# EAGLE design kuechenlicht (EAGLE 6.5.0)
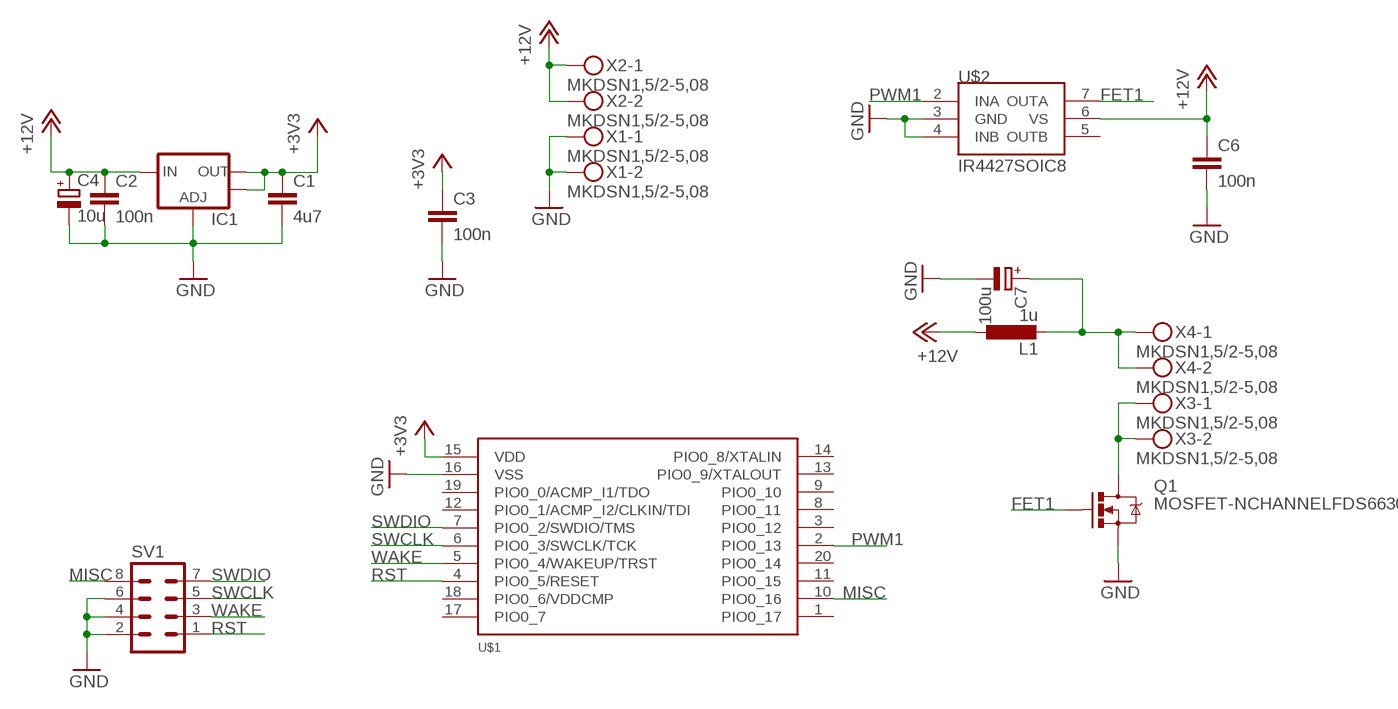
[diagram p0: schematic, sheet 1]

## Parts
C1  4u7  C-EUC0805  [C0805]
C2  100n  C-EUC0805  [C0805]
C3  100n  C-EUC0805  [C0805]
C4  10u  CPOL-EUE2.5-6  [E2,5-6]
C6  100n  C-EUC0805  [C0805]
C7  100u  CPOL-EUPANASONIC_D-BIGPAD  [PANASONIC_D-BIGPAD]
IC1  V_REG_LM1117SOT223  [SOT223]
L1  1u  L-EUPISR-BIGPAD  [PISR-BIGPAD]
Q1  MOSFET-NCHANNELFDS6630A  [SO08]
SV1  MA04-2  [MA04-2]
U$1  LPC812M101JD20  [SOIC20WIDE]
U$2  IR4427SOIC8  [SOIC8]
X1  MKDSN1,5/2-5,08  [MKDSN1,5/2-5,08]
X2  MKDSN1,5/2-5,08  [MKDSN1,5/2-5,08]
X3  MKDSN1,5/2-5,08  [MKDSN1,5/2-5,08]
X4  MKDSN1,5/2-5,08  [MKDSN1,5/2-5,08]

## Nets
+3V3: C1.1 C3.1 IC1.2(OUT) IC1.4(OUT) U$1.15(VDD)
+12V: C2.1 C4.+ C6.1 IC1.3(IN) L1.1 U$2.6(VS) X2.1 X2.2
FET1: Q1.4(G) U$2.7(OUTA)
GND: C1.2 C2.2 C3.2 C4.- C6.2 C7.- IC1.1(ADJ) Q1.1(S) Q1.2(S) Q1.3(S) SV1.2 SV1.4 SV1.6 U$1.16(VSS) U$2.3(GND) U$2.4(INB) X1.1 X1.2
MISC: SV1.8 U$1.10(PIO0_16)
N$1: C7.+ L1.2 X4.1 X4.2
OUT: Q1.5(D) Q1.6(D) Q1.7(D) Q1.8(D) X3.1 X3.2
PWM1: U$1.2(PIO0_13) U$2.2(INA)
RST: SV1.1 U$1.4(PIO0_5/RESET)
SWCLK: SV1.5 U$1.6(PIO0_3/SWCLK/TCK)
SWDIO: SV1.7 U$1.7(PIO0_2/SWDIO/TMS)
WAKE: SV1.3 U$1.5(PIO0_4/WAKEUP/TRST)
Unconnected: U$1.1(PIO0_17) U$1.3(PIO0_12) U$1.8(PIO0_11) U$1.9(PIO0_10) U$1.11(PIO0_15) U$1.12(PIO0_1/ACMP_I2/CLKIN/TDI) U$1.13(PIO0_9/XTALOUT) U$1.14(PIO0_8/XTALIN) U$1.17(PIO0_7) U$1.18(PIO0_6/VDDCMP) U$1.19(PIO0_0/ACMP_I1/TDO) U$1.20(PIO0_14) U$2.5(OUTB)

## Library data of the parts
C1-C3 C6 = rcl:C-EU: CAPACITOR, European symbol
C4 = rcl:CPOL-EU: POLARIZED CAPACITOR, European symbol
C7 = florolf:CPOL-EU: POLARIZED CAPACITOR, European symbol
IC1 = SparkFun-PowerIC:V_REG_LM1117: Voltage Regulator LM1117 Standard adjustable voltage regulator but in SMD form. Spark Fun Electronics SKU : COM-00595
L1 = florolf:L-EU: INDUCTOR, European symbol
Q1 = SparkFun-DiscreteSemi:MOSFET-NCHANNEL: Common NMOSFET Parts MFG P/N Store ID Prod ID FDD8780 TRANS-09984 SI7820DN TRANS-11055 FDS6630A IC-08089 2N7002PW TRANS-11151 FQP30N06L COM-10213 TRANS-10060 BSS123LT1G TRANS-08345 BSS138 TRANS-00830 BS170 2N7000; PROD_ID: IC-08089
SV1 = con-lstb:MA04-2: PIN HEADER; OC_FARNELL: unknown; OC_NEWARK: unknown
U$1 = LPC800:LPC812M101JD20
U$2 = florolf:IR4427
X1-X4 = con-phoenix-508:MKDSN1,5/2-5,08: MKDSN 1,5/ 2-5,08 Printklemme Nennstrom: 13,5 A Nennspannung: 250 V Rastermaß: 5,08 mm Polzahl: 2 Anschlussart: Schraubanschluss Montage: Löten Anschlussrichtung Leiter/Platine: 0 ° Artikelnummer: 1729128 Source: http://eshop.phoenixcontact.com .. 1729128.pdf; MPN: MKDSN 1,5/2-5.08; OC_FARNELL: 1792903; OC_NEWARK: 30M2397

## Board
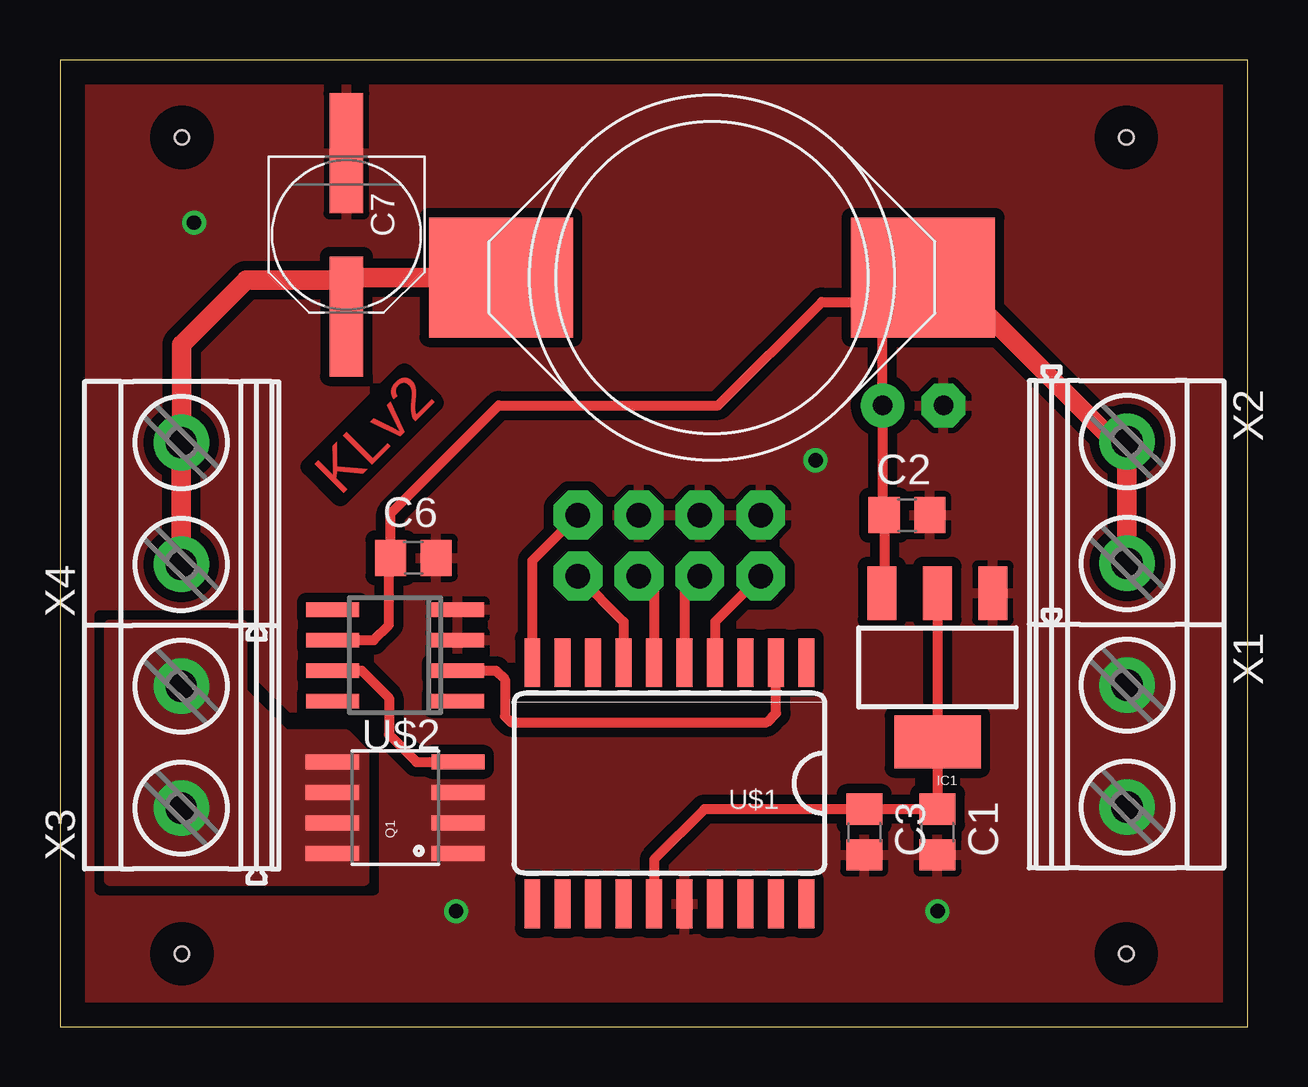
[diagram p1: board, top side]
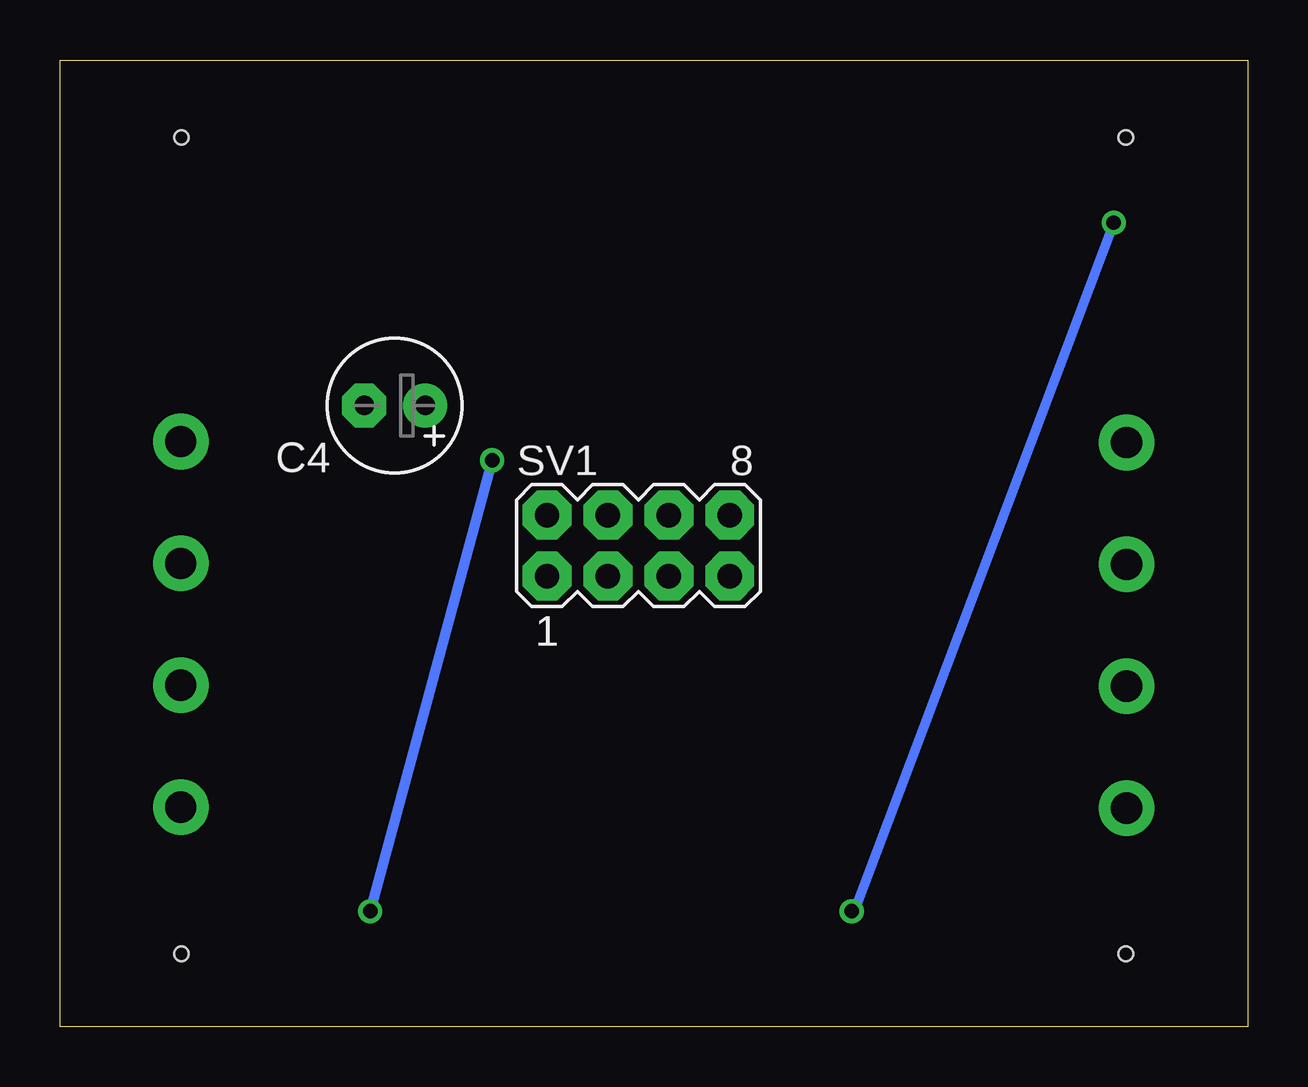
[diagram p2: board, bottom side, seen from below]

Size 49.51 x 40.31 mm. Coordinates in mm from the lower left corner, seen from the top.
Outline: 0,0 49.51,0 49.51,40.31 0,40.31 0,0
Copper layers (1*16): Top 0.035mm / dielectric 1.5mm / Bottom 0.035mm
Design rules "fraesen *": minimum track width 10mil, minimum drill 24mil, track to track 0.4mm, track to pad 0.4mm, pad to pad 0.4mm, via to via 0.4mm, smd to smd 0.4mm, copper to edge 40mil, drill to drill 8mil, minimum pad ring 20mil, minimum via ring 8mil, stop-mask expansion 4mil, vias tented up to drill 0mil, thermal gap 10mil
Holes 0.6 mm at 5.08,3.05 44.45,3.05 44.45,37.08 5.08,37.08

### Footprints (pad centres in the part's own frame; a part is rotated, then mirrored left to right if it is on the bottom)
C0805 = smd 1.3 x 1.5: 1 -0.95,0; 2 0.95,0
E2,5-6 = drill 0.813 pad 1.6: + -1.27,0 | drill 0.813 pad 1.6 octagon: - 1.27,0
PANASONIC_D-BIGPAD = smd 5 x 1.4: + 3.4,0; - -3.4,0
SOT223 = smd 1.219 x 2.235: 1 -2.311,-3.099; 2 0,-3.099; 3 2.311,-3.099 | smd 3.6 x 2.2: 4 0,3.099
PISR-BIGPAD = smd 6 x 5: 1 -8.8,0; 2 8.8,0
SO08 = smd 0.61 x 2.21: 1 -1.905,-2.616; 2 -0.635,-2.616; 3 0.635,-2.616; 4 1.905,-2.616; 5 1.905,2.616; 6 0.635,2.616; 7 -0.635,2.616; 8 -1.905,2.616
MA04-2 = drill 1.016 octagon: 1 -3.81,-1.27; 2 -3.81,1.27; 3 -1.27,-1.27; 4 -1.27,1.27; 5 1.27,-1.27; 6 1.27,1.27; 7 3.81,-1.27; 8 3.81,1.27
SOIC20WIDE = smd 0.66 x 2.032: 1 -5.715,-5.029; 2 -4.445,-5.029; 3 -3.175,-5.029; 4 -1.905,-5.029; 5 -0.635,-5.029; 6 0.635,-5.029; 7 1.905,-5.029; 8 3.175,-5.029; 9 4.445,-5.029; 10 5.715,-5.029; 11 5.715,5.029; 12 4.445,5.029; 13 3.175,5.029; 14 1.905,5.029; 15 0.635,5.029; 16 -0.635,5.029; 17 -1.905,5.029; 18 -3.175,5.029; 19 -4.445,5.029; 20 -5.715,5.029
SOIC8 = smd 0.6 x 2.2: 1 -1.905,-2.6; 2 -0.635,-2.6; 3 0.635,-2.6; 4 1.905,-2.6; 5 1.905,2.6; 6 0.635,2.6; 7 -0.635,2.6; 8 -1.905,2.6
MKDSN1,5/2-5,08 = drill 1.3 pad 2: 1 -2.561,0.025; 2 2.519,0.025

### Placement (x,y rotation side)
C1  36.58,8.13 270 top
C2  35.31,21.34 0 top
C3  33.53,8.13 270 top
C4  35.56,25.91 180 bottom
C6  14.73,19.56 0 top
C7  11.94,33.02 270 top
IC1  36.58,14.99 180 top
L1  27.18,31.24 180 top
Q1  13.97,9.14 90 top
SV1  25.4,20.07 0 bottom
U$1  25.4,10.16 180 top
U$2  13.97,15.49 90 top
X1  44.45,11.68 270 top
X2  44.45,21.84 270 top
X3  5.08,11.68 90 top
X4  5.08,21.84 90 top

### Tracks (layer width: path | path; a pad name or v marks a point on that pad's centre or on a via)
+3V3
  Top 0.406: U$1.15 24.77,6.99 26.86,9.08 C3.1 C1.1 IC1.4 IC1.2
+12V
  Top 0.406: U$2.6 13.08,16.13 13.72,16.76 13.72,19.49 C6.1 13.78,21.4 18.29,25.91 27.43,25.91 31.75,30.23 34.96,30.23 | IC1.3 34.36,18.18 C2.1 34.29,21.4 C4.+ 34.29,29.55 34.96,30.23 | L1.1 35.26,30.52 34.96,30.23
  Top 0.813: X2.1 44.48,23.88 | 44.48,23.88 X2.2 | L1.1 37.11,31.24 44.48,23.88
FET1
  Top 0.406: U$2.7 12.57,14.86 13.72,13.72 13.72,12.19 14.86,11.05 Q1.4
GND  (via drill 0.6)
  Bottom 0.406: v5.59,33.53 16.51,4.57 | v31.5,23.62 v36.58,4.83
  other vias: 16.51,4.83
  pour Top (rank 2): -1.27,41.91 -1.27,-1.27 50.8,-1.27 50.8,41.91
  pour Top (no thermals): 14.99,10.41 18.29,10.41 18.29,6.35 14.99,6.35
  pour Top (no thermals): 40.39,16.76 40.39,6.1 48.01,6.1 48.01,16.76
MISC
  Top 0.406: SV1.8 19.68,19.43 U$1.10
N$1
  Top 0.813: X4.1 X4.2 5.08,24.39 5.08,28.45 7.76,31.13 11.8,31.13 11.94,30.99 | C7.+ 11.94,30.99 | 11.94,30.99 12.19,31.24 L1.2
OUT
  pour Top (no thermals): 2.03,16.76 2.03,6.1 12.7,6.1 12.7,11.43 11.94,12.19 9.4,12.19 7.62,13.97 7.62,16.76
PWM1
  Top 0.406: U$2.2 18.16,14.86 18.54,14.48 18.54,12.95 18.8,12.7 29.46,12.7 29.84,13.08 U$1.2
RST
  Top 0.406: SV1.1 27.3,16.89 U$1.4
SWCLK
  Top 0.406: SV1.5 24.77,18.16 U$1.6
SWDIO
  Top 0.406: SV1.7 23.5,16.89 U$1.7
WAKE
  Top 0.406: SV1.3 26.04,18.16 U$1.5

### Text on the board
Top: KLv2